# Altium schematic sheet Interface_DS18B20.SchDoc
size A4
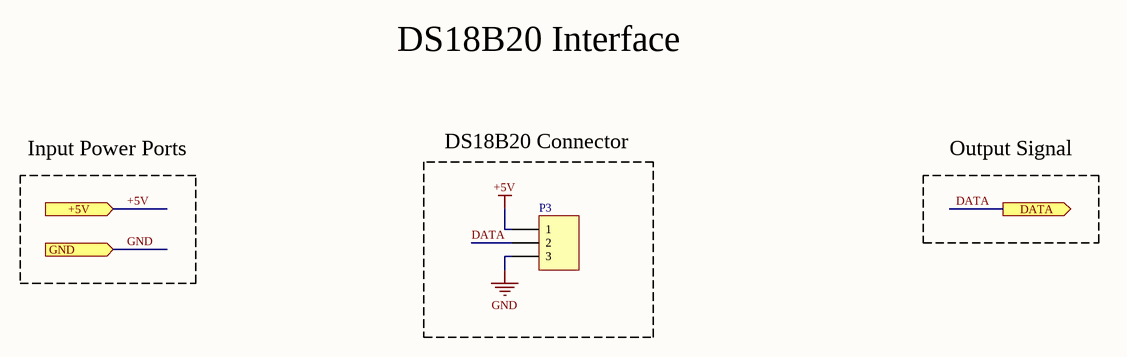
[diagram p0: Interface_DS18B20.SchDoc]

## Parts
P3  DS18B20 Connector  [HDR1X3]  (value not drawn)

## Blocks framed on the sheet
DS18B20 Connector: P3

## Ports
+5V (in), DATA (out), GND (in)

## Nets
+5V: P3.1 ; port +5V
GND: P3.3 ; port GND
DATA: P3.2 ; port DATA

## Notes on the sheet
- DS18B20 Interface
- Input Power Ports
- Output Signal

## Library data of the parts
P3 = CMP-002-00161-1: Header, 3-Pin; LatestRevisionDate: 17-Jul-2002; Source: Miscellaneous Connectors.SchLib; Design Item ID: Header 3; Component Type: Standard; LatestRevisionNote: Re-released for DXP Platform.; Signal Integrity: Connector; Publisher: Altium Limited; Pins: 3